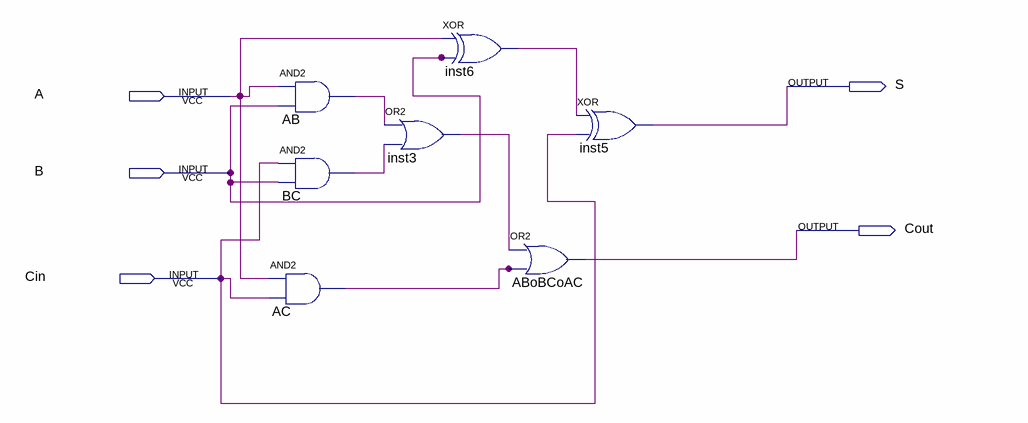
[diagram p0: schematic sheet]
// Quartus schematic SasinGudipatisasinkg2.bdf as structural Verilog: 7 symbols, 5 pins
module SasinGudipatisasinkg2 (
  input  A,
  input  B,
  input  Cin,
  output S,
  output Cout
);

  wire AB_out, AC_out, BC_out, inst3_out, inst6_out;

  and AB (AB_out, A, B);
  and BC (BC_out, Cin, B);
  and AC (AC_out, A, Cin);
  or inst3 (inst3_out, AB_out, BC_out);
  xor inst6 (inst6_out, A, B);
  or ABoBCoAC (Cout, inst3_out, AC_out);
  xor inst5 (S, inst6_out, Cin);
endmodule
